# EAGLE design 7-segment (EAGLE 7.5.0)
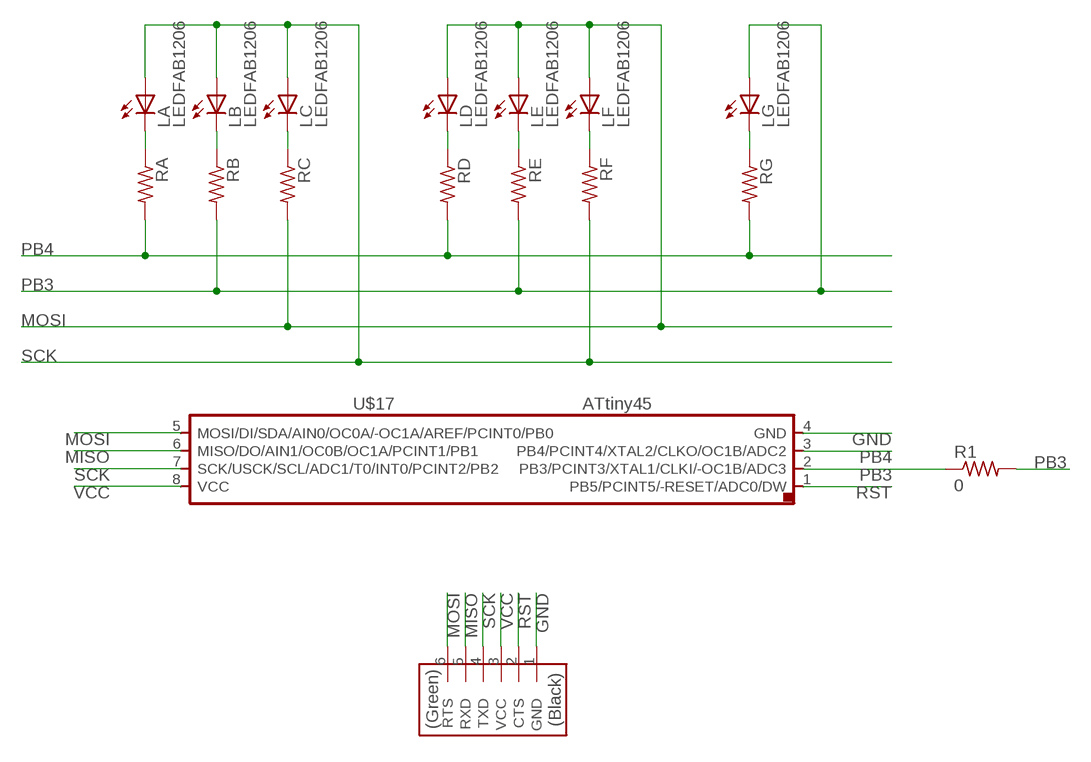
[diagram p0: schematic, sheet 1]

## Parts
LA  LEDFAB1206  [LED1206FAB]
LB  LEDFAB1206  [LED1206FAB]
LC  LEDFAB1206  [LED1206FAB]
LD  LEDFAB1206  [LED1206FAB]
LE  LEDFAB1206  [LED1206FAB]
LF  LEDFAB1206  [LED1206FAB]
LG  LEDFAB1206  [LED1206FAB]
R1  0  RES-US1206FAB  [R1206FAB]
RA  RES-US1206FAB  [R1206FAB]
RB  RES-US1206FAB  [R1206FAB]
RC  RES-US1206FAB  [R1206FAB]
RD  RES-US1206FAB  [R1206FAB]
RE  RES-US1206FAB  [R1206FAB]
RF  RES-US1206FAB  [R1206FAB]
RG  RES-US1206FAB  [R1206FAB]
U$3  FTDI-SMD-HEADER  [1X06SMD]
U$17  ATTINY45SI  [SOIC8]

## Nets
GND: U$3.1(GND) U$17.4(GND)
MISO: U$3.5(RXD) U$17.6(MISO/DO/AIN1/OC0B/OC1A/PCINT1/PB1)
MOSI: LD.1(A) LE.1(A) LF.1(A) RC.2 U$3.6(RTS) U$17.5(MOSI/DI/SDA/AIN0/OC0A/-OC1A/AREF/PCINT0/PB0)
N$2: LA.2(C) RA.1
N$4: LB.2(C) RB.1
N$5: LC.2(C) RC.1
N$6: LD.2(C) RD.1
N$7: LE.2(C) RE.1
N$8: LF.2(C) RF.1
N$11: LG.2(C) RG.1
PB3: LG.1(A) R1.1 R1.2 RB.2 RE.2 U$17.2(PB3/PCINT3/XTAL1/CLKI/-OC1B/ADC3)
PB4: RA.2 RD.2 RG.2 U$17.3(PB4/PCINT4/XTAL2/CLKO/OC1B/ADC2)
RST: U$3.2(CTS) U$17.1(PB5/PCINT5/-RESET/ADC0/DW)
SCK: LA.1(A) LB.1(A) LC.1(A) RF.2 U$3.4(TXD) U$17.7(SCK/USCK/SCL/ADC1/T0/INT0/PCINT2/PB2)
VCC: U$3.3(VCC) U$17.8(VCC)

## Library data of the parts
LA LB LC LD LE LF LG = fab:LED: LED
R1 RA RB RC RD RE RF RG = fab:RES-US: Resistor (US Symbol) Variants with postfix FAB are widened to allow the routing of internal traces
U$3 = fab:FTDI-SMD-HEADER
U$17 = fab:ATTINY45

## Net classes
0 default: width 0.457 mm, clearance 1.626 mm

## Board
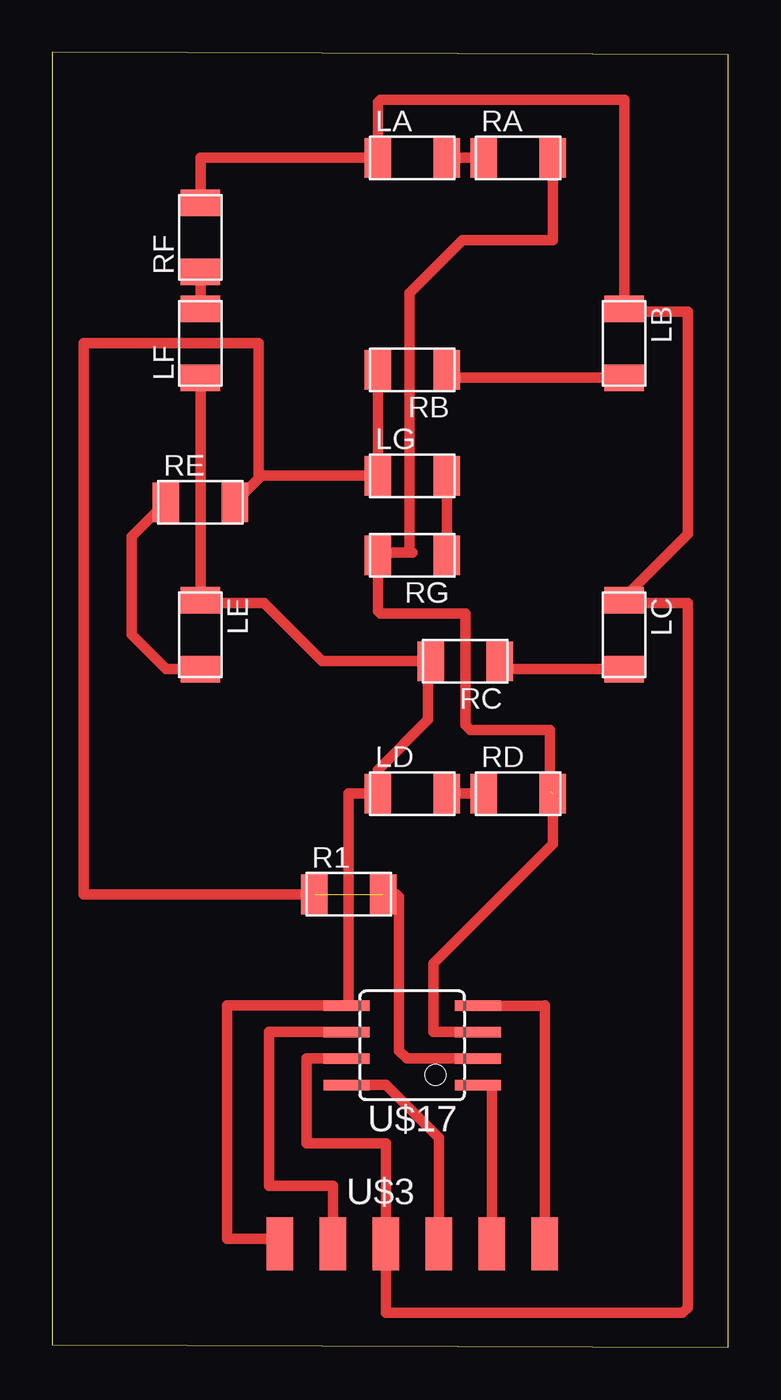
[diagram p1: board, top side]

Size 32.44 x 62.09 mm. Coordinates in mm from the lower left corner, seen from the top.
Outline: 0,0.13 32.44,0 32.44,61.97 0,62.09 0,0.13
Copper layers (1*16): Top 0.035mm / dielectric 1.5mm / Bottom 0.035mm
Design rules "fab": minimum track width 0.3mm, minimum drill 32mil, track to track 0.397mm, track to pad 0.397mm, pad to pad 0.397mm, via to via 0.397mm, smd to smd 0.315mm, copper to edge 40mil, drill to drill 16mil, minimum pad ring 10mil, minimum via ring 8mil, stop-mask expansion 4mil, vias tented up to drill 0mil, thermal gap 10mil

### Footprints (pad centres in the part's own frame; a part is rotated, then mirrored left to right if it is on the bottom)
LED1206FAB = smd 1.27 x 1.905: 1 -1.651,0; 2 1.651,0
R1206FAB = smd 1.27 x 1.905: 1 -1.651,0; 2 1.651,0
1X06SMD = smd 2.54 x 1.27: 1 0,6.35; 2 0,3.81; 3 0,1.27; 4 0,-1.27; 5 0,-3.81; 6 0,-6.35
SOIC8 = smd 0.5 x 2.2: 1 -1.905,-3.154; 2 -0.645,-3.154; 3 0.625,-3.154; 4 1.895,-3.154; 5 1.905,3.154; 6 0.635,3.154; 7 -0.635,3.154; 8 -1.905,3.154

### Placement (x,y rotation side)
LA  17.27,57.02 0 top
LB  27.43,48.13 270 top
LC  27.43,34.16 270 top
LD  17.27,26.54 0 top
LE  7.11,34.16 270 top
LF  7.11,48.13 90 top
LG  17.27,41.78 0 top
R1  14.22,21.72 0 top
RA  22.35,57.02 0 top
RB  17.27,46.86 180 top
RC  19.81,32.89 180 top
RD  22.35,26.54 0 top
RE  7.11,40.51 0 top
RF  7.11,53.21 90 top
RG  17.27,37.97 180 top
U$3  17.27,4.95 270 top
U$17  17.27,14.48 90 top

### Tracks (layer width: path | path; a pad name or v marks a point on that pad's centre or on a via)
GND
  Top 0.508: U$3.1 23.62,16.38 23.61,16.37 U$17.4
MISO
  Top 0.508: U$3.5 13.46,7.75 10.41,7.75 10.41,15.11 U$17.6
MOSI
  Top 0.508: U$3.6 10.67,5.21 8.38,5.21 8.38,16.38 U$17.5 14.22,16.49 14.22,26.54 LD.1 | LD.1 15.75,26.67 15.75,26.8 | LF.1 LE.1 7.24,35.69 10.16,35.69 12.95,32.89 RC.2 18.03,32.77 18.03,30.1 15.62,27.69 LD.1
N$2
  Top 0.508: LA.2 RA.1
N$4
  Top 0.508: RB.1 19.3,46.48 LB.2
N$5
  Top 0.508: RC.1 21.84,32.51 LC.2
N$6
  Top 0.508: LD.2 RD.1
N$7
  Top 0.508: RE.1 3.81,38.86 3.81,34.16 5.46,32.51 LE.2
N$8
  Top 0.508: RF.1 LF.2
N$11
  Top 0.508: LG.2 RG.1
PB3  (1 unrouted)
  Top 0.508: RB.2 LG.1 10.03,41.78 RE.2 9.91,41.66 9.91,48.13 1.52,48.13 1.52,21.72 R1.1 | U$17.2 20.42,13.84 17.02,13.84 16.64,14.22 16.64,21.59 16.51,21.72 R1.2
PB4  (1 unrouted)
  Top 0.508: RA.2 24,53.09 19.68,53.09 17.14,50.55 17.14,38.23 17.27,38.1 15.75,38.1 RG.2 15.62,35.31 15.75,35.18 19.81,35.18 19.81,29.85 20.07,29.59 23.88,29.59 23.88,26.67 | U$17.3 20.42,15.11 18.29,15.11 18.29,18.42 24,24.13 RD.2
RST
  Top 0.508: U$3.2 21.08,12.57 U$17.1
SCK
  Top 0.508: U$17.7 12.19,13.84 12.19,9.78 16,9.78 U$3.4 16,1.65 30.23,1.65 30.48,1.91 30.48,35.69 27.56,35.69 LC.1 27.43,35.94 30.48,38.99 30.48,49.66 27.56,49.66 LB.1 27.43,59.82 15.75,59.82 15.62,59.69 LA.1 7.11,57.02 RF.2
VCC
  Top 0.508: U$3.3 18.54,10.03 16,12.57 U$17.8